# Altium schematic sheet Power_Stage.SchDoc: Half Bridge Schematic For Geec Power Electronics
size A4; Author: Conor Farrell; SheetNumber: 2; SheetTotal: 6
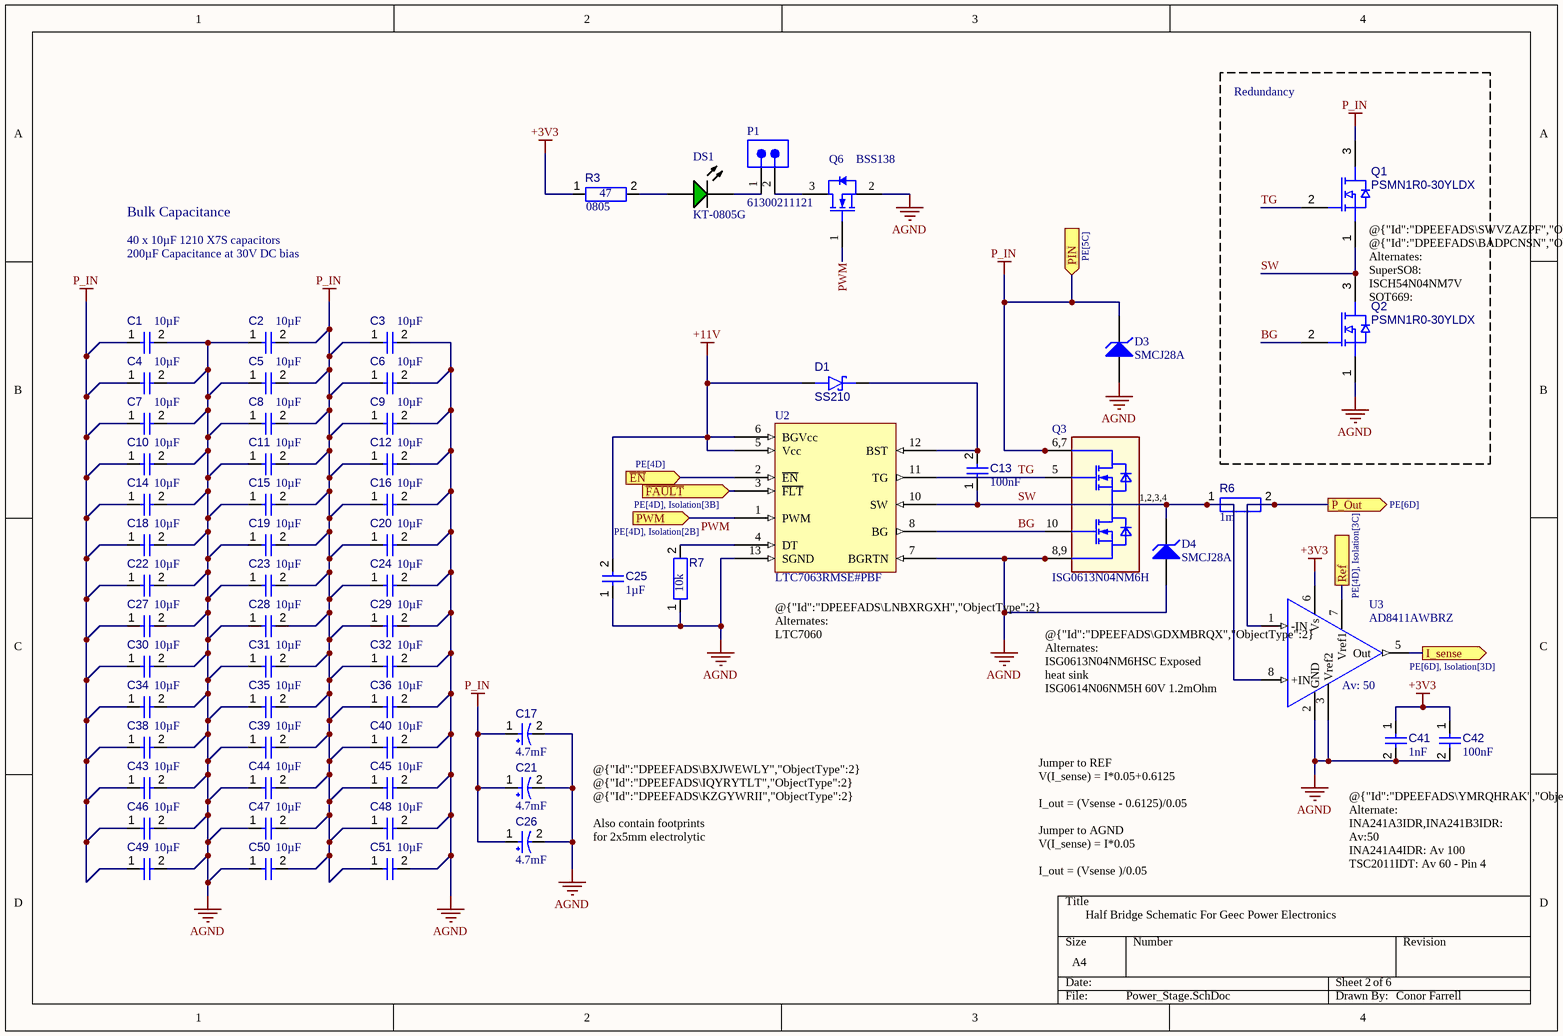
[diagram p0: Power_Stage.SchDoc]

## Parts
C1  value 10µF  [FP-GCM32E-0_3-IPC_C]  (hidden comment: GCM32EC71H106KA03L)
C2  value 10µF  [FP-GCM32E-0_3-IPC_C]  (hidden comment: GCM32EC71H106KA03L)
C3  value 10µF  [FP-GCM32E-0_3-IPC_C]  (hidden comment: GCM32EC71H106KA03L)
C4  value 10µF  [FP-GCM32E-0_3-IPC_C]  (hidden comment: GCM32EC71H106KA03L)
C5  value 10µF  [FP-GCM32E-0_3-IPC_C]  (hidden comment: GCM32EC71H106KA03L)
C6  value 10µF  [FP-GCM32E-0_3-IPC_C]  (hidden comment: GCM32EC71H106KA03L)
C7  value 10µF  [FP-GCM32E-0_3-IPC_C]  (hidden comment: GCM32EC71H106KA03L)
C8  value 10µF  [FP-GCM32E-0_3-IPC_C]  (hidden comment: GCM32EC71H106KA03L)
C9  value 10µF  [FP-GCM32E-0_3-IPC_C]  (hidden comment: GCM32EC71H106KA03L)
C10  value 10µF  [FP-GCM32E-0_3-IPC_C]  (hidden comment: GCM32EC71H106KA03L)
C11  value 10µF  [FP-GCM32E-0_3-IPC_C]  (hidden comment: GCM32EC71H106KA03L)
C12  value 10µF  [FP-GCM32E-0_3-IPC_C]  (hidden comment: GCM32EC71H106KA03L)
C13  value 100nF  [CAPC3216X06N]  (hidden comment: C1206C104K1RACTU)
C14  value 10µF  [FP-GCM32E-0_3-IPC_C]  (hidden comment: GCM32EC71H106KA03L)
C15  value 10µF  [FP-GCM32E-0_3-IPC_C]  (hidden comment: GCM32EC71H106KA03L)
C16  value 10µF  [FP-GCM32E-0_3-IPC_C]  (hidden comment: GCM32EC71H106KA03L)
C17  value 4.7mF  [UVR1J472MRD-Footprint-1]  (hidden comment: UVR1J472MRD)
C18  value 10µF  [FP-GCM32E-0_3-IPC_C]  (hidden comment: GCM32EC71H106KA03L)
C19  value 10µF  [FP-GCM32E-0_3-IPC_C]  (hidden comment: GCM32EC71H106KA03L)
C20  value 10µF  [FP-GCM32E-0_3-IPC_C]  (hidden comment: GCM32EC71H106KA03L)
C21  value 4.7mF  [UVR1J472MRD-Footprint-1]  (hidden comment: UVR1J472MRD)
C22  value 10µF  [FP-GCM32E-0_3-IPC_C]  (hidden comment: GCM32EC71H106KA03L)
C23  value 10µF  [FP-GCM32E-0_3-IPC_C]  (hidden comment: GCM32EC71H106KA03L)
C24  value 10µF  [FP-GCM32E-0_3-IPC_C]  (hidden comment: GCM32EC71H106KA03L)
C25  value 1µF  [CAPC3216X180X20ML20]  (hidden comment: CL31B105KBHNNNE)
C26  value 4.7mF  [UVR1J472MRD-Footprint-1]  (hidden comment: UVR1J472MRD)
C27  value 10µF  [FP-GCM32E-0_3-IPC_C]  (hidden comment: GCM32EC71H106KA03L)
C28  value 10µF  [FP-GCM32E-0_3-IPC_C]  (hidden comment: GCM32EC71H106KA03L)
C29  value 10µF  [FP-GCM32E-0_3-IPC_C]  (hidden comment: GCM32EC71H106KA03L)
C30  value 10µF  [FP-GCM32E-0_3-IPC_C]  (hidden comment: GCM32EC71H106KA03L)
C31  value 10µF  [FP-GCM32E-0_3-IPC_C]  (hidden comment: GCM32EC71H106KA03L)
C32  value 10µF  [FP-GCM32E-0_3-IPC_C]  (hidden comment: GCM32EC71H106KA03L)
C34  value 10µF  [FP-GCM32E-0_3-IPC_C]  (hidden comment: GCM32EC71H106KA03L)
C35  value 10µF  [FP-GCM32E-0_3-IPC_C]  (hidden comment: GCM32EC71H106KA03L)
C36  value 10µF  [FP-GCM32E-0_3-IPC_C]  (hidden comment: GCM32EC71H106KA03L)
C38  value 10µF  [FP-GCM32E-0_3-IPC_C]  (hidden comment: GCM32EC71H106KA03L)
C39  value 10µF  [FP-GCM32E-0_3-IPC_C]  (hidden comment: GCM32EC71H106KA03L)
C40  value 10µF  [FP-GCM32E-0_3-IPC_C]  (hidden comment: GCM32EC71H106KA03L)
C41  value 1nF  [FP-CL31-IPC_A]  (hidden comment: CL31B102KGFNNNE)
C42  value 100nF  [CAPC3216X06N]  (hidden comment: C1206C104K1RACTU)
C43  value 10µF  [FP-GCM32E-0_3-IPC_C]  (hidden comment: GCM32EC71H106KA03L)
C44  value 10µF  [FP-GCM32E-0_3-IPC_C]  (hidden comment: GCM32EC71H106KA03L)
C45  value 10µF  [FP-GCM32E-0_3-IPC_C]  (hidden comment: GCM32EC71H106KA03L)
C46  value 10µF  [FP-GCM32E-0_3-IPC_C]  (hidden comment: GCM32EC71H106KA03L)
C47  value 10µF  [FP-GCM32E-0_3-IPC_C]  (hidden comment: GCM32EC71H106KA03L)
C48  value 10µF  [FP-GCM32E-0_3-IPC_C]  (hidden comment: GCM32EC71H106KA03L)
C49  value 10µF  [FP-GCM32E-0_3-IPC_C]  (hidden comment: GCM32EC71H106KA03L)
C50  value 10µF  [FP-GCM32E-0_3-IPC_C]  (hidden comment: GCM32EC71H106KA03L)
C51  value 10µF  [FP-GCM32E-0_3-IPC_C]  (hidden comment: GCM32EC71H106KA03L)
D1  SS210  [DIOM4226X24N]
D3  SMCJ28A  [FAIR-DO-214AB-2_V]
D4  SMCJ28A  [FAIR-DO-214AB-2_V]
DS1  KT-0805G  [WL-SMCW_0805_150080xx75000]
P1  61300211121  [61300211121]
Q1  PSMN1R0-30YLDX  [NXP-SOT669_L]
Q2  PSMN1R0-30YLDX  [NXP-SOT669_L]
Q3  ISG0613N04NM6H  [IFX-PG-VITFN-10-1-V]
Q6  BSS138  [FAIR-SOT23-3_V]
R3  value 47  Case/Package: 0805  [RESC2013X70X40ML20T20]  (hidden comment: 0805W8F470JT5E)
R6  value 1m  [RESC6331X09N]  (hidden comment: CHSA2512R0010F)
R7  value 10k  [RESC3216X60X45ML15T20]  (hidden comment: 1206W4F1002T5E)
U2  LTC7063RMSE#PBF  [TSOP65P490X110_HS-13N]
U3  AD8411AWBRZ  [SOIC127P600X175-8N]

## Blocks framed on the sheet
Redundancy: Q1 Q2

## Ports
I_sense (out, see PE[6D], Isolation[3D]), P_Out (out, see PE[6D]), PIN (in, see PE[5C]), PWM (in, see PE[4D], Isolation[2B]), Ref (see PE[4D], Isolation[3C]), ~{EN} (in, see PE[4D]), ~{FAULT} (in, see PE[4D], Isolation[3B])

## Nets
+3V3: C41.1 C42.1 R3.1 U3.6(Vs)
+11V: C25.2 D1.2(A) U2.5(Vcc) U2.6(BGVcc)
AGND: C1.2 C2.1 C3.2 C4.2 C5.1 C6.2 C7.2 C8.1 C9.2 C10.2 C11.1 C12.2 C14.2 C15.1 C16.2 C17.2 C18.2 C19.1 C20.2 C21.2 C22.2 C23.1 C24.2 C25.1 C26.2 C27.2 C28.1 C29.2 C30.2 C31.1 C32.2 C34.2 C35.1 C36.2 C38.2 C39.1 C40.2 C41.2 C42.2 C43.2 C44.1 C45.2 C46.2 C47.1 C48.2 C49.2 C50.1 C51.2 D3.1(A) D4.1(A) Q2.1(S) Q3.8(S3) Q3.9(S4) Q6.2(S) R7.1 U2.7(BGRTN) U2.13(SGND) U3.2(GND) U3.3(Vref2)
P_IN: C1.1 C2.2 C3.1 C4.1 C5.2 C6.1 C7.1 C8.2 C9.1 C10.1 C11.2 C12.1 C14.1 C15.2 C16.1 C17.1 C18.1 C19.2 C20.1 C21.1 C22.1 C23.2 C24.1 C26.1 C27.1 C28.2 C29.1 C30.1 C31.2 C32.1 C34.1 C35.2 C36.1 C38.1 C39.2 C40.1 C43.1 C44.2 C45.1 C46.1 C47.2 C48.1 C49.1 C50.2 C51.1 D3.2(K) Q1.3(D) Q3.6(D3) Q3.7(D4) ; port PIN
~{EN}: U2.2(~{EN}) ; port ~{EN}
~{FAULT}: U2.3(~{FLT}) ; port ~{FAULT}
BG: Q2.2(G) Q3.10(G2) U2.8(BG)
I_sense: U3.5(Out) ; port I_sense
P_Out: R6.2 U3.1(-IN) ; port P_Out
PWM: Q6.1(G) U2.1(PWM) ; port PWM
Ref: U3.7(Vref1) ; port Ref
SW: C13.1 D4.2(K) Q1.1(S) Q2.3(D) Q3.1(S1) Q3.2(S2) Q3.3(D1) Q3.4(D2) R6.1 U2.10(SW) U3.8(+IN)
TG: Q1.2(G) Q3.5(G1) U2.11(TG)
NetC13_2: C13.2 D1.1(K) U2.12(BST)
NetDS1_1: DS1.1(A) R3.2
NetDS1_2: DS1.2(K) P1.1
NetP1_2: P1.2 Q6.3(D)
NetR7_2: R7.2 U2.4(DT)

## Notes on the sheet
- Bulk Capacitance
- 40 x 10µF 1210 X7S capacitors
- 200µF Capacitance at 30V DC bias
- @{"Id":"DPEEFADS\SWVZAZPF","ObjectType":2} @{"Id":"DPEEFADS\BADPCNSN","ObjectType":2} Alternates:
  SuperSO8: ISCH54N04NM7V
  SOT669: PSMNR90-40YSN
- (near U2) @{"Id":"DPEEFADS\LNBXRGXH","ObjectType":2} Alternates:
  LTC7060
- @{"Id":"DPEEFADS\GDXMBRQX","ObjectType":2} Alternates:
  ISG0613N04NM6HSC Exposed heat sink
  ISG0614N06NM5H 60V 1.2mOhm
- @{"Id":"DPEEFADS\BXJWEWLY","ObjectType":2} @{"Id":"DPEEFADS\IQYRYTLT","ObjectType":2} @{"Id":"DPEEFADS\KZGYWRII","ObjectType":2}
  Also contain footprints for 2x5mm electrolytic capacitors
- Jumper to REF
  V(I_sense) = I*0.05+0.6125
  I_out = (Vsense - 0.6125)/0.05
  Jumper to AGND
  V(I_sense) = I*0.05
  I_out = (Vsense )/0.05
- @{"Id":"DPEEFADS\YMRQHRAK","ObjectType":2} Alternate:
  INA241A3IDR,INA241B3IDR: Av:50
  INA241A4IDR: Av 100
  TSC2011IDT: Av 60 - Pin 4 shutdown
- (in symbol CMP-007-000000-2) 6,7; 1,2,3,4; 8,9
- (in symbol CMP-014-00003-5) Av: 50

## Library data of the parts
C1-C12 C14-C16 C18-C20 C22-C24 C27-C32 C34-C36 C38-C40 C43-C51 = CMP-001-00085-1: 50V 10uF X7S ±10% 1210 Multilayer Ceramic Capacitors MLCC - SMD/SMT ROHS; Tolerance: 10%; Max Operating Temperature: 125°C; Case Code (Metric): 3225; Mounting Technology: Surface Mount; Case/Package: 1210; Min Operating Temperature: -55°C; Voltage Rating: 50V; Dielectric: X7S
C13 C42 = CMP-001-00083-1: Ceramic Capacitor, Multilayer, Ceramic, 200V, 10% +Tol, 10% -Tol, X7R, 15% TC, 0.01uF, 1206; Voltage Rating: 100V; Case/Package: 1206; Pins: 2; Mounting Technology: Surface Mount; Min Operating Temperature: -55°C; Max Operating Temperature: 125°C; Tolerance: 10%
C17 C21 C26 = CMP-001-00084-4: Radial Can ALUMINUM ELECTROLYTIC CAPACITOR UVR 63V 4700muF ±20% 0.866Dia 22.00mm; Ripple Current: 3.2A; Pins: 2; Mounting Technology: Through Hole; Tolerance: 20%; Case/Package: Radial; Max Operating Temperature: 85°C; Voltage Rating: 63V; Min Operating Temperature: -40°C
C25 = CMP-001-00086-1: Ceramic Capacitor, Multilayer, Ceramic, 50V, 10% +Tol, 10% -Tol, X7R, +-15% TC, 1uF, Surface Mount, 1206 inch; Mounting Technology: Surface Mount; JLCPN: C1848; Max Operating Temperature: 125°C; Min Operating Temperature: -55°C; Case/Package: 1206; Tolerance: 10%; Voltage Rating: 50V
C41 = CMP-001-00090-1: Ceramic Capacitor, Multilayer, Ceramic, 500V, 10% +Tol, 10% -Tol, X7R, +-15% TC, 1nF, Surface Mount, 1206 inch; Min Operating Temperature: -55°C; Mounting Technology: Surface Mount; Tolerance: 10%; Max Operating Temperature: 125°C; Case/Package: 1206; Voltage Rating: 500V
D1 = CMP-004-00033-2: Rectifier Diode, Schottky, 1 Phase, 1 Element, 2A, 100V V(RRM), Silicon, DO-214AA; Forward Voltage: 850mV; Pins: 2; Min Operating Temperature: -65°C; Max Operating Temperature: 150°C; JLCPN: C14996; Case/Package: SMB; Forward Current: 2A
D3 D4 = CMP-004-00035-1: SMCJ Series 45.4 V 1.5 kW Surface Mount Uni-Directional TVS Diode - DO-214AB; Max Surge Current: 33.1A; JLCPN: C42371538; Min Operating Temperature: -65°C; Max Operating Temperature: 150°C; Mounting Technology: Surface Mount; Pins: 2
DS1 = CMP-007-00037-1: -40℃~+85℃ 100mW 120° 2.6V~3.1V 430mcd 513nm~528nm 525nm 5mA Emerald Green 0805 LED Indication - Discrete ROHS; Colour: Green; Case/Package: 0805; JLCPN: C2297
P1 = CMP-002-00208-1: WR-PHD Pin Header, THT, Vertical, pitch 2.54mm, 1 Row, 2P; Manufacturer: Wurth Elektronik; Withstanding Voltage: 500V; Rated Current: 3A; Contact Resistance: 20mOhm; Working Voltage: 250V; Source: WR-PHD.SchLib; Mount: Through Hole; ComponentLink1Description: Website Link; Operating Temperature Max: 105°C; ComponentLink1URL: https://www.we-online.com/redexpert/article/61300211121?ad; Category: Board-to-Board Connectors; ComponentLink2URL: https://www.we-online.com/redexpert/spec/61300211121?ad; Number of Rows: 1; Orientation: Vertical; ComponentLink2Description: Datasheet Link; Operating Temperature Min: -40°C; Manufacturer Part Number: 61300211121; Match Code: WR-PHD; Design Item ID: 61300211121; Component Type: Standard; Pin Count: 2; Gender: Pin Header; Pitch: 2.54mm; Packaging: Bag; Pins: 2
Q1 Q2 = CMP-013-00029-7: N-channel Logic Level MOSFET, 30 V, 300 A, -55 to 175 degC, 5-Pin SOT669, RoHS, Tape and Reel; pin to pad: 1>1+2+3 2>4 3>5; Transistor Type: 1N-Channel; Vgs (Max): 20V; RoHS Compliant: True; Pins: 5
Q3 = CMP-007-000000-2: Small Signal Dual N-Channel Enhancement Transistor, Pin 1 Source, 2 Source, 3 Drain, 4 Drain, 5 Gate, 6 Drain, 7 Drain, 8 Source, 9 Source 10 Gate, 10 Pins; Manufacturer: Infineon Technologies; Design Item ID: ISG0613N04NM6H; Source: ISG0613N04NM6H.SchLib; Manufacturer Order Number: ISG0613N04NM6H; PackageReference: PG-VITFN-10-1
Q6 = CMP-013-00021-4: N-Channel Logic Level Enhancement Mode Field Effect Transistor, 220 mA, 50 V, -55 to 150 degC, 3-Pin SOT-23, RoHS, Tape and Reel; Manufacturer: Fairchild; Elements: 1; Nominal Vgs: 1.3V; Resistance: 0.7Ohm; Typical Rise Time: 9ns; Rds On Max: 3.5Ohm; Nominal Dual Supply Voltage: 50V; Input Capacitance: 27pF; Package Version: Rev. 12, 03/2016; Power: 360mW; Packaging: TapeandReel; Package Description: 3-Pin Small Outline Transistor, Body 2.92 x 1.325 mm, Pitch 0.95 mm; Datasheet URL: https://www.fairchildsemi.com/datasheets/BS/BSS138.pdf; Min Operating Temperature: -55°C; Pins: 3; RoHS Compliant: True; Package Reference: SOT23-3; Package Quantity: 1; Case/Package: TO-236-3; Mounting Technology: SM; Max Operating Temperature: 150°C; Datasheet Version: Rev. C, 10/2005
R3 = CMP-009-00191-2: Thick Film Resistors - SMD RMC 0805 1/8W 1% T/R-5000; Power: 125mW; JLCPN: C17714
R6 = CMP-009-00182-2: Fixed Resistor, Metal Strip, 5W, 1ohm, 0.0707V, 1% +/-Tol, 100ppm/Cel, Surface Mount, 2512; Tolerance: 1%; Max Operating Temperature: 170°C; Min Operating Temperature: -55°C; Mounting Technology: Surface Mount
R7 = CMP-009-00184-2: Res Thick Film 1206 10K Ohm 1% 0.25W(1/4W) ±100ppm/C Pad SMD T/R; JLCPN: C17902; Case/Package: 1206
U2 = CMP-00024-00008-3: Driver 6A 2-OUT High Side/Low Side Half Brdg Inv/Non-Inv 12-Pin MSOP EP Tube
U3 = CMP-014-00003-5: SP Amp Current Sense Amp Single 5.5V 8-Pin SOIC N Tube Automotive AEC-Q100; MPN: AD8411AWBRZ; JLCPN: C20047590